# EAGLE design WhiteDwarf_Core (EAGLE 8.7.1)
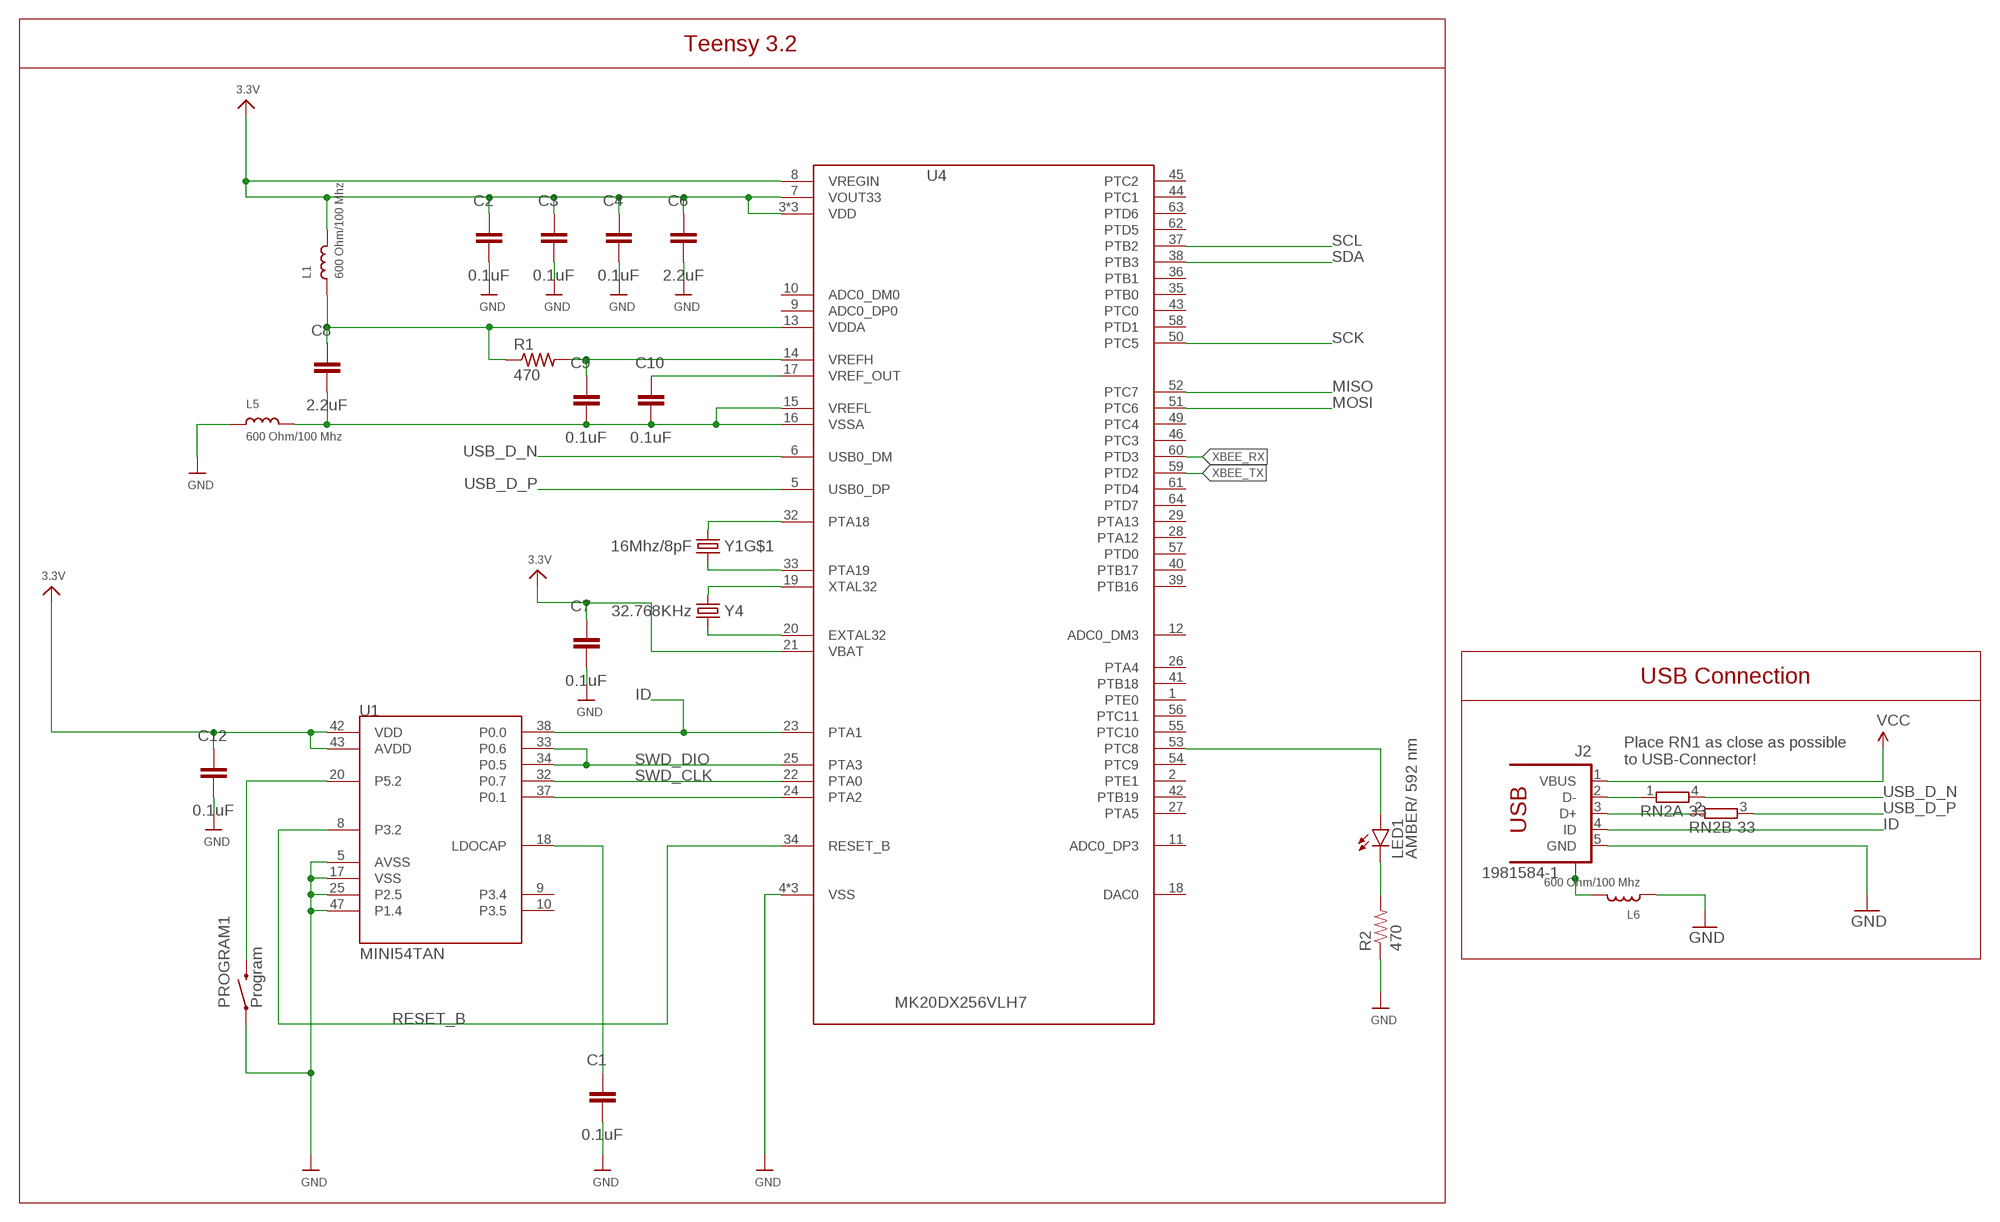
[diagram p0: schematic, sheet 1]

## Parts
C1  0.1uF  CC0402JRNPO9BN100  [CAP_0402]
C2  0.1uF  CC0402JRNPO9BN100  [CAP_0402]
C3  0.1uF  CC0402JRNPO9BN100  [CAP_0402]
C4  0.1uF  CC0402JRNPO9BN100  [CAP_0402]
C6  2.2uF  CC0402JRNPO9BN220  [CAP_0402]
C7  0.1uF  CC0402JRNPO9BN100  [CAP_0402]
C8  2.2uF  CC0402JRNPO9BN100  [CAP_0402]
C9  0.1uF  CC0402JRNPO9BN100  [CAP_0402]
C10  0.1uF  CC0402JRNPO9BN100  [CAP_0402]
C12  0.1uF  CC0402JRNPO9BN100  [CAP_0402]
J2  1981584-1  [1981584-1]
L1  600 Ohm/100 Mhz  INDUCTOR-BK2125HM601-T  [0805]
L5  600 Ohm/100 Mhz  INDUCTOR-BK2125HM601-T  [0805]
L6  600 Ohm/100 Mhz  INDUCTOR-BK2125HM601-T  [0805]
LED1  AMBER/ 592 nm  LED-AMBER  [LED-0603]
PROGRAM1  Program  SWITCH-MOMENTARY-2-SMD-1101NE  [TACTILE-SWITCH-1101NE]
R1  470  RC0402JR-070RL  [RES_0402]
R2  470  RESISTOR-470  [0603-RES]
RN2  33  2R-NEXB34V  [EXB34V]
U1  MINI54TAN  [MINI54TAN]
U4  MK20DX256VLH7  [MK20DX256VLH7]
Y1  16Mhz/8pF  CRYSTAL/SMD-5X3-GND16MHZ/8PF  [CRYSTAL-SMD-5X3]
Y4  32.768KHz  CRYSTAL/32.768KHZ/SMD-TXC_7A  [CRYSTAL-TXC-7A]

## Nets
3.3V: C2.1 C3.1 C4.1 C6.1 C7.1 C12.1 L1.2 U1.42(VDD) U1.43(AVDD) U4.3(VDD) U4.7(VOUT33) U4.8(VREGIN) U4.21(VBAT) U4.30(VDD) U4.48(VDD)
GND: C1.2 C2.2 C3.2 C4.2 C6.2 C7.2 C12.2 J2.5(GND) L5.1 L6.1 PROGRAM1.P$1 R2.1 U1.5(AVSS) U1.17(VSS) U1.25(P2.5) U1.47(P1.4) U4.4(VSS) U4.31(VSS) U4.47(VSS)
ID: J2.4(ID) U1.38(P0.0) U4.23(PTA1)
MISO: U4.52(PTC7)
MOSI: U4.51(PTC6)
N$1: U1.37(P0.1) U4.24(PTA2)
N$2: PROGRAM1.P$2 U1.20(P5.2)
N$3: C1.1 U1.18(LDOCAP)
N$4: U4.32(PTA18) Y1.3
N$5: U4.33(PTA19) Y1.1
N$6: U4.19(XTAL32) Y4.P$2
N$7: U4.20(EXTAL32) Y4.P$1
N$8: LED1.A U4.53(PTC8)
N$9: LED1.C R2.2
RESET_B: U1.8(P3.2) U4.34(RESET_B)
SCK: U4.50(PTC5)
SCL: U4.37(PTB2)
SDA: U4.38(PTB3)
SWD_CLK: U1.32(P0.7) U4.22(PTA0)
SWD_DIO: U1.33(P0.6) U1.34(P0.5) U4.25(PTA3)
USB_CON_N1 [USB]: J2.2(D-) RN2.1
USB_CON_P1 [USB]: J2.3(D+) RN2.2
USB_D_N [USB]: RN2.4 U4.6(USB0_DM)
USB_D_P [USB]: RN2.3 U4.5(USB0_DP)
USB_SHIELD1: J2.S1 J2.S2 J2.S3 J2.S4 L6.2
VCC: J2.1(VBUS)
VDDA1: C8.1 L1.1 R1.1 U4.13(VDDA)
VREF_OUT1: C10.1 U4.17(VREF_OUT)
VREFH1: C9.1 R1.2 U4.14(VREFH)
VREFL1: C8.2 C9.2 C10.2 L5.2 U4.15(VREFL) U4.16(VSSA)
XBEE_RX: U4.60(PTD3)
XBEE_TX: U4.59(PTD2)
Unconnected: U1.9(P3.4) U1.10(P3.5) U4.1(PTE0) U4.2(PTE1) U4.9(ADC0_DP0) U4.10(ADC0_DM0) U4.11(ADC0_DP3) U4.12(ADC0_DM3) U4.18(DAC0) U4.26(PTA4) U4.27(PTA5) U4.28(PTA12) U4.29(PTA13) U4.35(PTB0) U4.36(PTB1) U4.39(PTB16) U4.40(PTB17) U4.41(PTB18) U4.42(PTB19) U4.43(PTC0) U4.44(PTC1) U4.45(PTC2) U4.46(PTC3) U4.49(PTC4) U4.54(PTC9) U4.55(PTC10) U4.56(PTC11) U4.57(PTD0) U4.58(PTD1) U4.61(PTD4) U4.62(PTD5) U4.63(PTD6) U4.64(PTD7) Y1.2(GND:GND) Y1.4(GND:GND)

## Notes on the sheet
- Teensy 3.2
- USB Connection
- Place RN1 as close as possible
  to USB-Connector!

## Library data of the parts
C1-C4 C7-C10 C12 = Resistor_Capacitor:CC0402JRNPO9BN100: CAP CER 10PF 50V C0G/NPO 0402 Manufacturer's datasheet <http://www.yageo.com/documents/recent/UPY-GP_NP0_16V-to-50V_16.pdf>; CREATED_BY: PCBLayout.com; DIGIKEY_PART_NUMBER: 311-1014-2-ND; MANUFACTURER: Yageo; MPN: CC0402JRNPO9BN100; PACKAGE: SMD 0402
C6 = Resistor_Capacitor:CC0402JRNPO9BN220: CAP CER 22PF 50V C0G/NPO 0402 Manufacturer's datasheet <http://www.yageo.com/documents/recent/UPY-GP_NP0_16V-to-50V_16.pdf>; CREATED_BY: PCBLayout.com; DIGIKEY_PART_NUMBER: 311-1018-2-ND; MANUFACTURER: Yageo; MPN: CC0402JRNPO9BN220; PACKAGE: SMD 0402
J2 = con-usb:1981584-1: Receptacle, micro-USB, type A/B Tyco Electronics; MF: Hirose; MPN: ZX62-AB-5PA(11)
L1 L5 L6 = appfruits:INDUCTOR: Inductors 0603: 10nH Ceramic Inductor - microwire antenna/RF (Digikey: 712-1434-2-ND) 0805: 560nH Ceramic Inductor - RF (Digikey: 553-1047-1-ND) 270nH Ceramic Inductor - Q = 40@250MHz, +-5%, 1 Ohm DC Resistance (Digikey: 535-10506-2-ND) 1007 (2518 Metric) SMT: 10µH 10% 250mOhm 820mA 1007 Inductor (Digikey: 587-2189-1-ND) 22µH 10% 500mOhm 580mA 1007 Inductor (Digikey: 587-2190-1-ND) 47µH 10% 950mOhm 420mA 1007 Inductor (Digikey: 587-2191-1-ND) 47µH 5% 100mOhm 1A 1008 Inductor (Digikey: 732-1816-1-ND) 5.0x5.0mm (Taiyo Yuden NR5040 Series) 6.8µH 20% 2.3A 64mOhm Inductor (Digikey: 587-2374-2-ND) 5.0x5.0mm (TDK VLC5045 Series) 4.7µH 20% 3.3A 34mOhm Inductor (Digikey: 445-6526-1-ND) 6.8µH 20% 2.7A 46mOhm Inductor (Digikey: 445-6527-1-ND) 6.0x6.0mm (TDK VLC6045 Series) 4.7µH 20% 3.8A 27mOhm Inductor (Digikey: 445-6538-2-ND) 6.8µH 20% 3A 41mOhm Inductor (Digikey: 445-6540-1-ND) 6.2µH 30% 2.2A 45mOhm Inductor (Digikey: SRR5028-6R2YCT-ND) - Not TDK VLC6045 but footprint should match 6.0x6.0mm (TDK SLF6045 Series) 6.8uH 30% 2A 33mOhm Inductor (Digikey: 445-4572-1-ND, Mouser: 810-SLF645T6R8N2R0PF) 6.0x6.0mm (Sumida CDRH5D28 Series) 6.2uH 30% 1.8A 45mOhm Inductor (Digikey: 308-1542-1-ND) Taiyo Yuden NR3015T2R2M - 2.2uH 20% 1.5A (Digikey: 587-1648-2-ND, Mouser: 963-NR3015T2R2M) - Used with TI TPS62172 CoilCraft RFID Transponder Coil - MA5532-AE (For use with AS3935 Lightning Sensor); MF: Taiyo Yuden; MPN: BK2125HM601-T
LED1 = appfruits:LED: LEDs Standard schematic elements and footprints for 5mm, 3mm, 1206, and 0603 sized LEDs. 5mm - Spark Fun Electronics SKU : COM-00529 (and others); MF: Avago Technologies; MPN: HSMA-C190
PROGRAM1 = SparkFun-Electromechanical:SWITCH-MOMENTARY-2: Various NO switches- pushbuttons, reed, etc; MF: C&K Components; MPN: RS-282G05A3-SM RT
R1 = Resistor_Capacitor:RC0402JR-070RL: RES SMD 0 OHM JUMPER 1/16W 0402 Manufacturer's datasheet <http://www.yageo.com/documents/recent/PYu-RC_Group_51_RoHS_L_10.pdf>; CREATED_BY: PCBLayout.com; DIGIKEY_PART_NUMBER: 311-0.0JRTR-ND; MANUFACTURER: Yageo; MPN: RC0402JR-070RL; PACKAGE: SMD 0402
R2 = appfruits:RESISTOR: Resistor Basic schematic elements and footprints for 0603, 1206, and PTH resistors.; MF: Panasonic; MPN: ERJ-3GEYJ471V
RN2 = resistor-dil:2R-N: Array Chip Resistor Source: Panasonic; MF: Panasonic; MPN: EXB-34V330JV; OC_FARNELL: unknown; OC_NEWARK: unknown
U1 = TeensyCustom:MINI54TAN: MINI54TAN Bootloader from PJRC.com, preprogrammed with Teensy 3.0 bootloader. https://www.pjrc.com/store/ic_mini54_tqfp.html
U4 = appfruits:MK20DX256VLH7; MF: Freescale; MPN: MK20DX256VLH7
Y1 = appfruits:CRYSTAL/SMD-5X3-GND; MF: ECS; MPN: ECS-160-8-30B-CKM
Y4 = appfruits:CRYSTAL/32.768KHZ/SMD-TXC_7A; MF: Epson Timing; MPN: FC-255 32.7680K-A3

## Net classes
1 USB: width 0.254 mm, drill 0.33 mm, clearance 0.159 mm

## Board
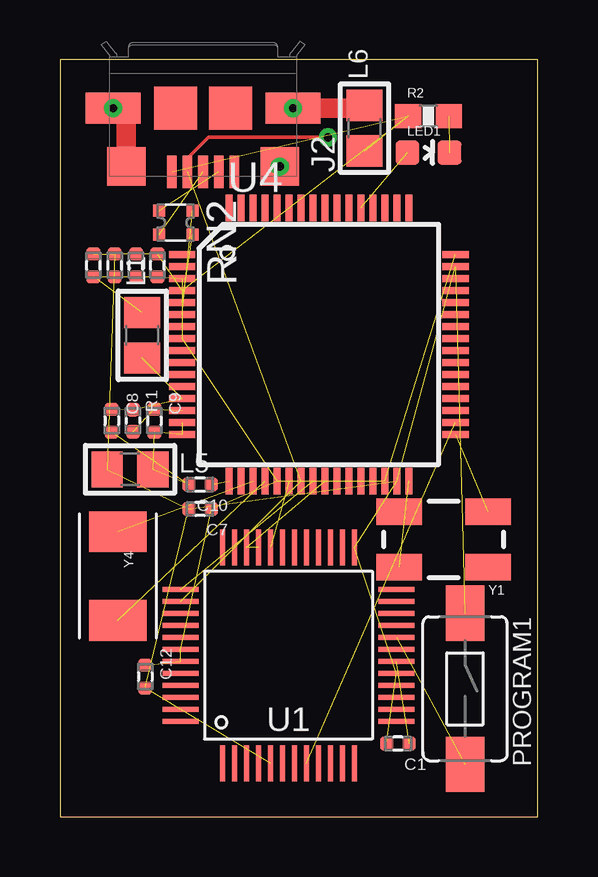
[diagram p1: board, top side]
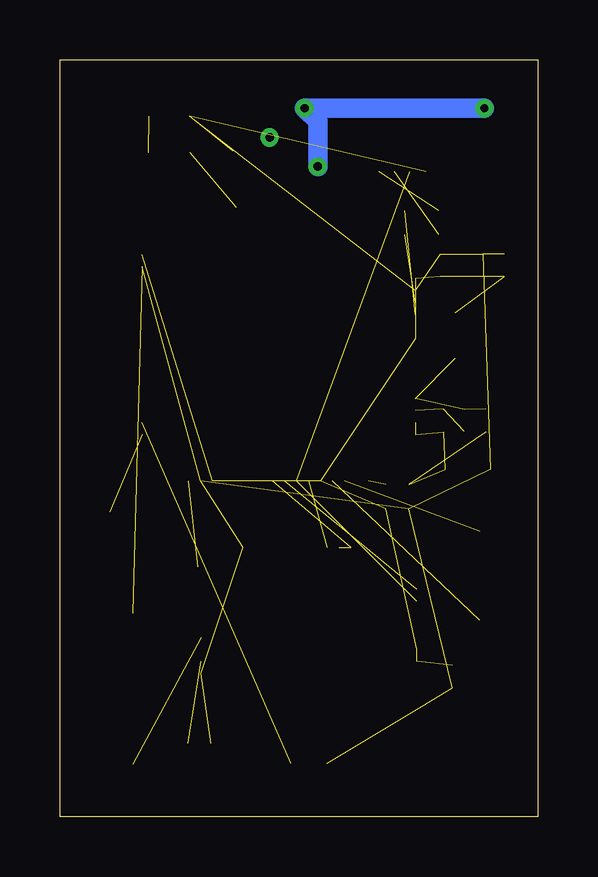
[diagram p2: board, bottom side, seen from below]

Size 19.92 x 31.55 mm. Coordinates in mm from the lower left corner, seen from the top.
Outline: 0,0 19.92,0 19.92,31.55 0,31.55 0,0
Copper layers (1*16): Top 0.035mm / dielectric 1.5mm / Bottom 0.035mm
Design rules "default": minimum track width 6mil, minimum drill 0.35mm, track to track 6mil, track to pad 6mil, pad to pad 6mil, via to via 6mil, smd to smd 6mil, copper to edge 40mil, drill to drill 6mil, minimum pad ring 10mil, minimum via ring 8mil, stop-mask expansion 4mil, vias tented up to drill 0mil, thermal gap 10mil

### Footprints (pad centres in the part's own frame; a part is rotated, then mirrored left to right if it is on the bottom)
CAP_0402 = smd 0.55 x 0.58: 1 -0.475,0; 2 0.475,0
1981584-1 = smd 0.4 x 1.35: 1 -1.3,4.1; 2 -0.65,4.1; 3 0,4.1; 4 0.65,4.1; 5 1.3,4.1 | smd 1.8 x 1.8: M1 -1.15,1.45; M2 1.15,1.45 | smd 2.3 x 1.3: S1 -3.75,1.45; S2 3.75,1.45 | smd 1.6 x 1.6: S3 -3.2,3.885; S4 3.2,3.885
0805 = smd 1.3 x 1.5: 1 -0.95,0; 2 0.95,0
LED-0603 = smd 1 x 1: A 0,-0.877; C 0,0.877
TACTILE-SWITCH-1101NE = smd 2.3 x 1.6: P$1 -3.15,0; P$2 3.15,0
RES_0402 = smd 0.58 x 0.58: 1 -0.46,0; 2 0.46,0
0603-RES = smd 1.1 x 1: 1 -0.85,0; 2 0.85,0
EXB34V = smd 0.5 x 0.5: 1 -0.5,-0.7; 2 0.5,-0.7; 3 0.5,0.7; 4 -0.5,0.7
MINI54TAN = smd 0.203 x 1.5: 1 -2.75,-4.5; 2 -2.25,-4.5; 3 -1.75,-4.5; 4 -1.25,-4.5; 5 -0.75,-4.5; 6 -0.25,-4.5; 7 0.25,-4.5; 8 0.75,-4.5; 9 1.25,-4.5; 10 1.75,-4.5; 11 2.25,-4.5; 12 2.75,-4.5; 25 2.75,4.5; 26 2.25,4.5; 27 1.75,4.5; 28 1.25,4.5; 29 0.75,4.5; 30 0.25,4.5; 31 -0.25,4.5; 32 -0.75,4.5; 33 -1.25,4.5; 34 -1.75,4.5; 35 -2.25,4.5; 36 -2.75,4.5 | smd 1.5 x 0.203: 13 4.5,-2.75; 14 4.5,-2.25; 15 4.5,-1.75; 16 4.5,-1.25; 17 4.5,-0.75; 18 4.5,-0.25; 19 4.5,0.25; 20 4.5,0.75; 21 4.5,1.25; 22 4.5,1.75; 23 4.5,2.25; 24 4.5,2.75; 37 -4.5,2.75; 38 -4.5,2.25; 39 -4.5,1.75; 40 -4.5,1.25; 41 -4.5,0.75; 42 -4.5,0.25; 43 -4.5,-0.25; 44 -4.5,-0.75; 45 -4.5,-1.25; 46 -4.5,-1.75; 47 -4.5,-2.25; 48 -4.5,-2.75
MK20DX256VLH7 = smd 1.1 x 0.285: 1 -5.7,3.75; 2 -5.7,3.25; 3 -5.7,2.75; 4 -5.7,2.25; 5 -5.7,1.75; 6 -5.7,1.25; 7 -5.7,0.75; 8 -5.7,0.25; 9 -5.7,-0.25; 10 -5.7,-0.75; 11 -5.7,-1.25; 12 -5.7,-1.75; 13 -5.7,-2.25; 14 -5.7,-2.75; 15 -5.7,-3.25; 16 -5.7,-3.75; 33 5.7,-3.75; 34 5.7,-3.25; 35 5.7,-2.75; 36 5.7,-2.25; 37 5.7,-1.75; 38 5.7,-1.25; 39 5.7,-0.75; 40 5.7,-0.25; 41 5.7,0.25; 42 5.7,0.75; 43 5.7,1.25; 44 5.7,1.75; 45 5.7,2.25; 46 5.7,2.75; 47 5.7,3.25; 48 5.7,3.75 | smd 0.285 x 1.1: 17 -3.75,-5.7; 18 -3.25,-5.7; 19 -2.75,-5.7; 20 -2.25,-5.7; 21 -1.75,-5.7; 22 -1.25,-5.7; 23 -0.75,-5.7; 24 -0.25,-5.7; 25 0.25,-5.7; 26 0.75,-5.7; 27 1.25,-5.7; 28 1.75,-5.7; 29 2.25,-5.7; 30 2.75,-5.7; 31 3.25,-5.7; 32 3.75,-5.7; 49 3.75,5.7; 50 3.25,5.7; 51 2.75,5.7; 52 2.25,5.7; 53 1.75,5.7; 54 1.25,5.7; 55 0.75,5.7; 56 0.25,5.7; 57 -0.25,5.7; 58 -0.75,5.7; 59 -1.25,5.7; 60 -1.75,5.7; 61 -2.25,5.7; 62 -2.75,5.7; 63 -3.25,5.7; 64 -3.75,5.7
CRYSTAL-SMD-5X3 = smd 1.9 x 1.1: 1 -1.85,-1.15; 2 1.85,-1.15; 3 1.85,1.15; 4 -1.85,1.15
CRYSTAL-TXC-7A = smd 1.7 x 2.4: P$1 1.85,0; P$2 -1.85,0

### Placement (x,y rotation side)
C1  14.1,3.05 180 top
C2  4.06,22.99 90 top
C3  1.4,22.99 90 top
C4  2.29,22.99 90 top
C6  3.17,22.99 90 top
C7  5.84,12.83 180 top
C8  2.16,16.51 270 top
C9  3.94,16.51 270 top
C10  5.84,13.84 180 top
C12  3.56,5.84 270 top
J2  5.97,30.99 180 top
L1  3.43,20.07 90 top
L5  2.92,14.48 0 top
L6  12.7,28.7 90 top
LED1  15.37,27.69 270 top
PROGRAM1  16.89,5.33 270 top
R1  3.05,16.51 270 top
R2  15.37,29.21 0 top
RN2  4.83,24.77 270 top
U1  9.53,6.73 0 top
U4  10.79,19.68 0 top
Y1  16,11.56 180 top
Y4  2.41,10.03 270 top

### Tracks (layer width: path | path; a pad name or v marks a point on that pad's centre or on a via)
3.3V  (14 unrouted)
GND  (18 unrouted)
ID  (via drill 0.35)  (2 unrouted)
  Top 0.152: v11.18,28.32 6.2,28.32 5.32,27.45 J2.4
N$1  (1 unrouted)
N$2  (1 unrouted)
N$3  (1 unrouted)
N$4  (1 unrouted)
N$5  (1 unrouted)
N$6  (1 unrouted)
N$7  (1 unrouted)
N$8  (1 unrouted)
N$9  (1 unrouted)
RESET_B  (1 unrouted)
SWD_CLK  (1 unrouted)
SWD_DIO  (2 unrouted)
USB_CON_N1  (1 unrouted)
USB_CON_P1  (1 unrouted)
USB_D_N  (1 unrouted)
USB_D_P  (1 unrouted)
USB_SHIELD1  (via drill 0.35)
  Top 0.813: J2.S2 2.77,28.99 J2.S4 | J2.S1 12.59,29.54 L6.2
  Bottom 0.813: J2.S2 J2.S1 9.17,28.99 J2.S3
  other vias: 2.22,29.54 9.72,29.54 9.17,27.1
VDDA1  (3 unrouted)
VREF_OUT1  (1 unrouted)
VREFH1  (2 unrouted)
VREFL1  (5 unrouted)